# Altium schematic sheet US_IF.SchDoc
size D; DocumentNumber: 2; SheetNumber: 3; SheetTotal: 4; PAGE_TITLE: Acoustic Interface
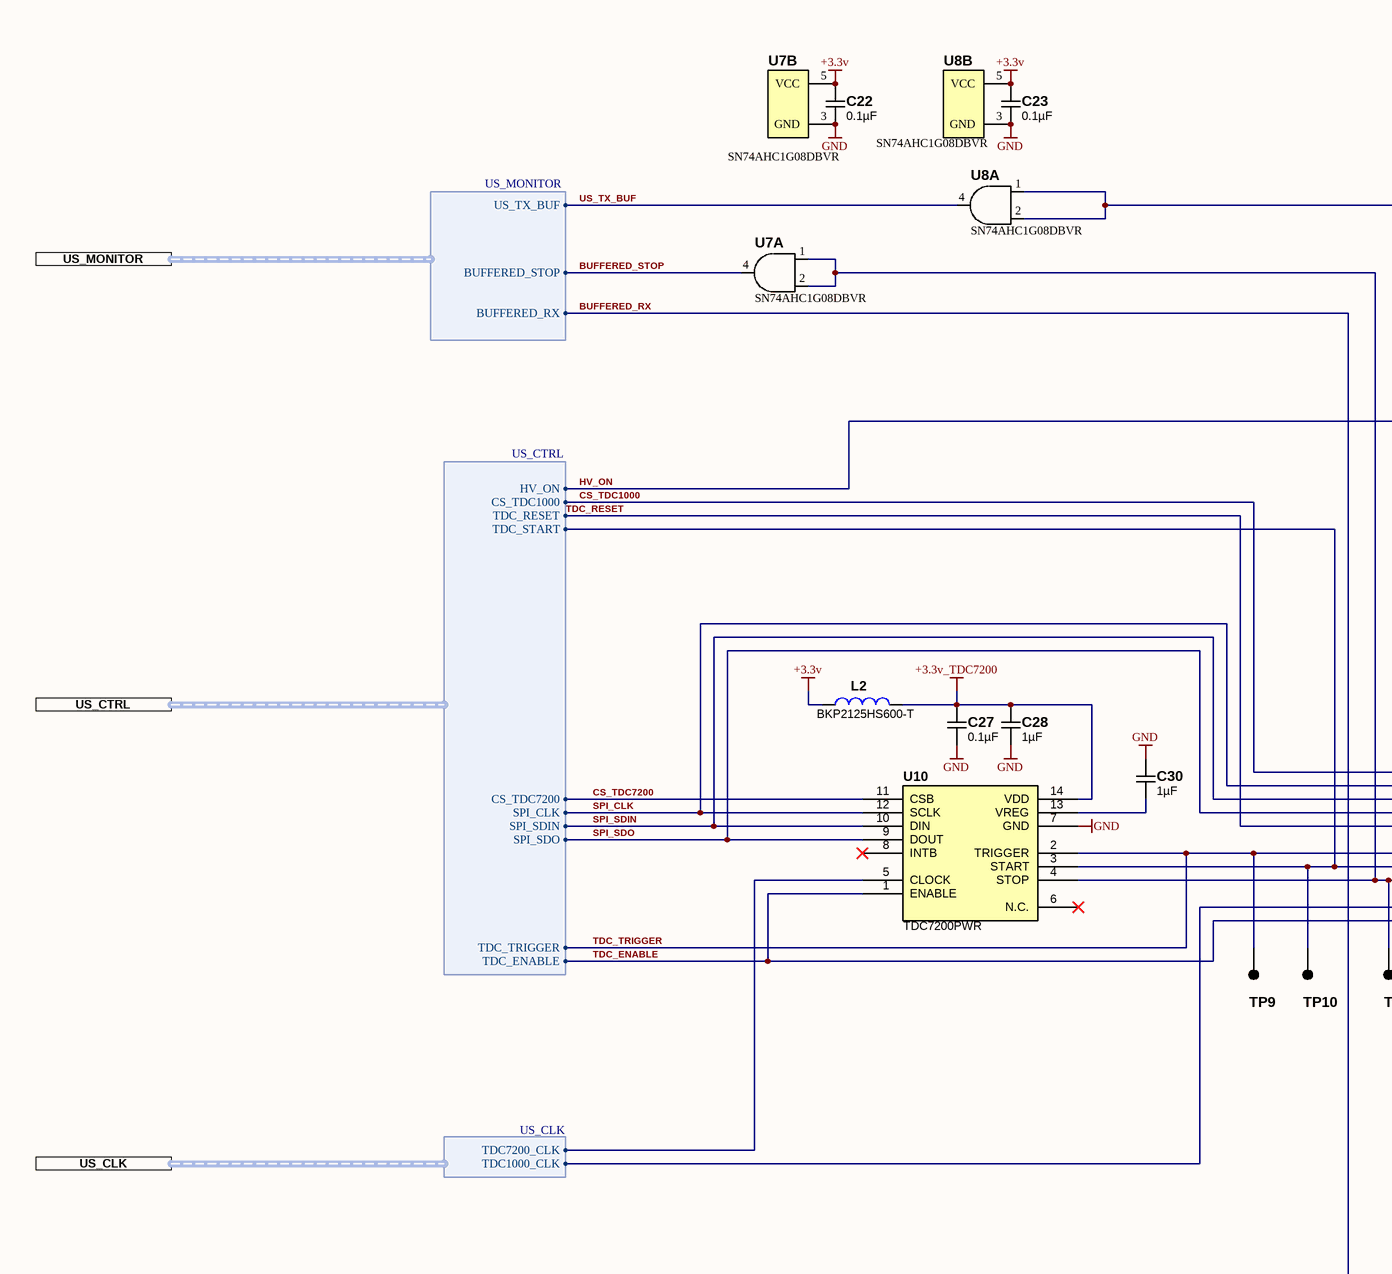
[diagram p0: US_IF.SchDoc, left]
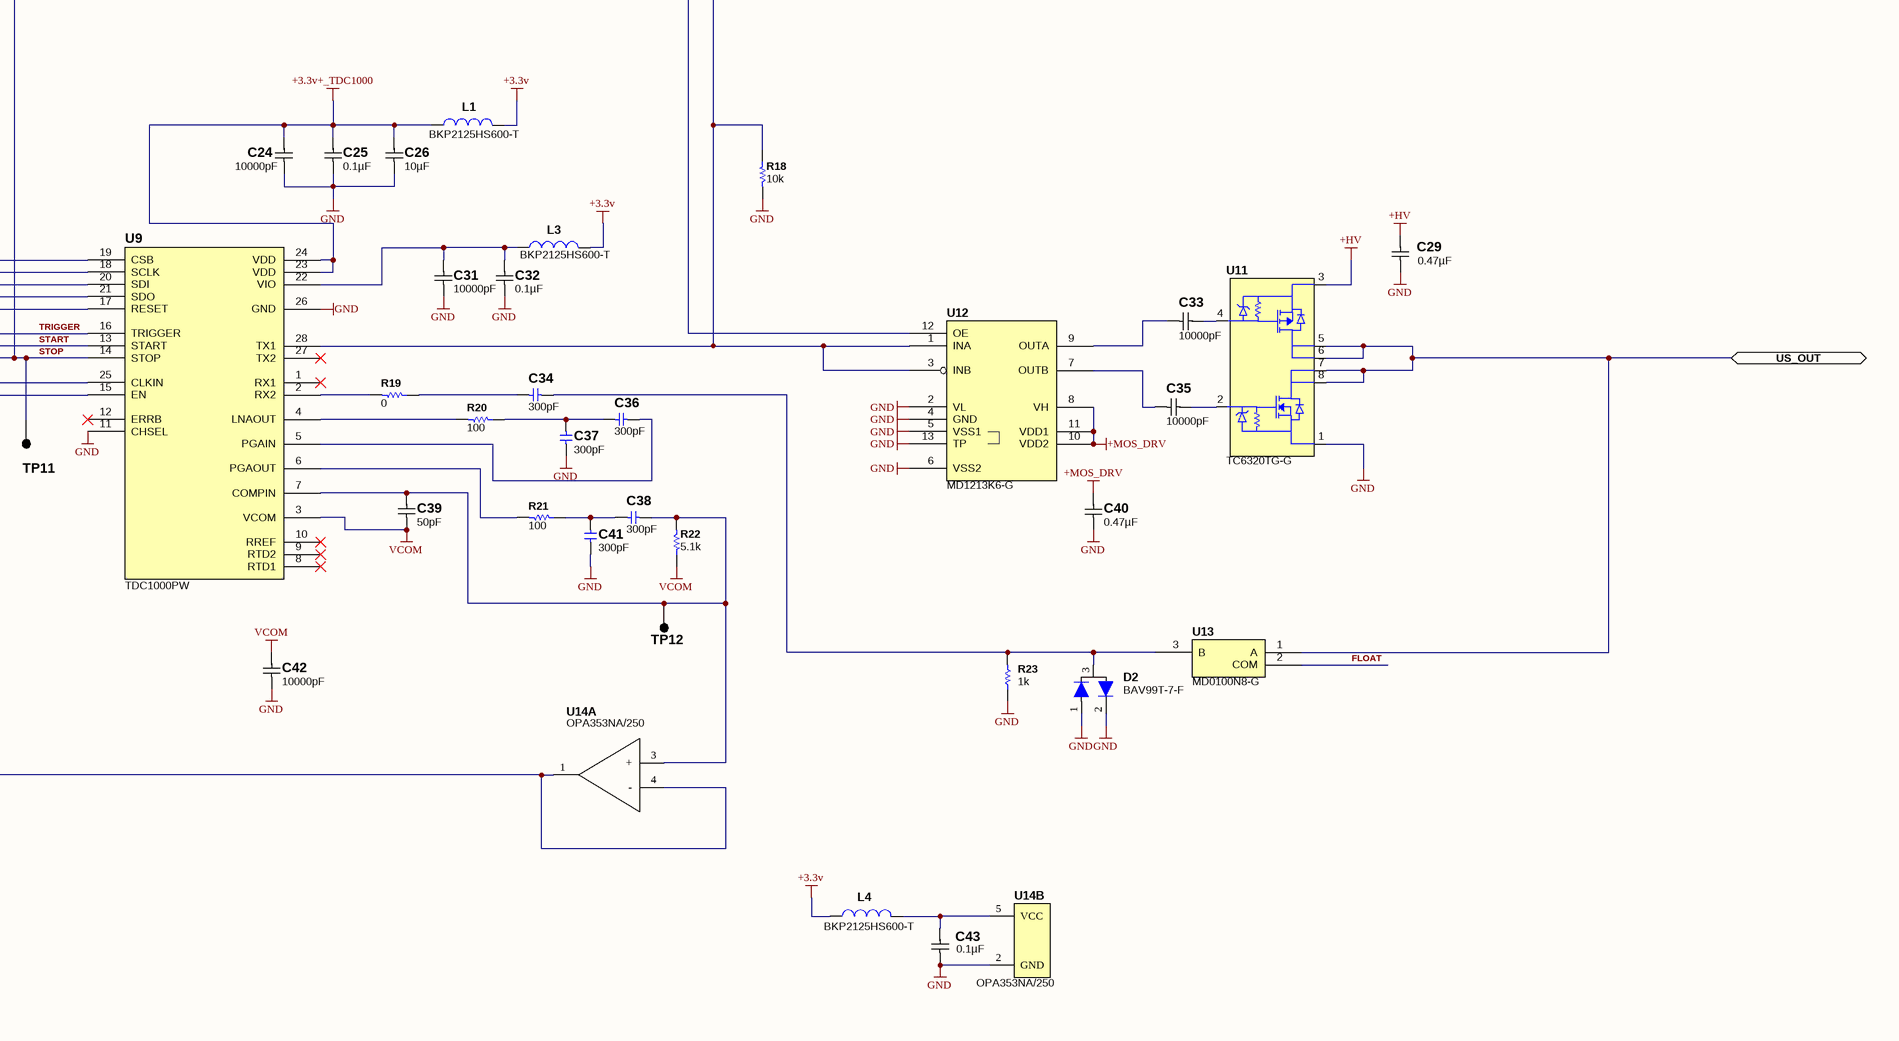
[diagram p1: US_IF.SchDoc, right]

## Parts
C22  0.1µF  [C0603_0.90MM_HD]
C23  0.1µF  [C0603_0.90MM_HD]
C24  10000pF  [C0603_0.95MM_HD]
C25  0.1µF  [C0603_0.90MM_HD]
C26  10µF  [C0805_1.45MM_HD]
C27  0.1µF  [C0603_0.90MM_HD]
C28  1µF  [C0603_0.95MM_HD]
C29  0.47µF  [C0805_1.45MM_HD]
C30  1µF  [C0603_0.95MM_HD]
C31  10000pF  [C0603_0.90MM_HD]
C32  0.1µF  [C0603_0.90MM_HD]
C33  10000pF  [C0603_0.95MM_HD]
C34  300pF  [C0603_0.90mm_MD]
C35  10000pF  [C0603_0.95MM_HD]
C36  300pF  [C0603_0.90mm_MD]
C37  300pF  [C0603_0.90mm_MD]
C38  300pF  [C0603_0.90mm_MD]
C39  50pF  [C0603_0.90MM_HD]
C40  0.47µF  [C0805_1.45MM_HD]
C41  300pF  [C0603_0.90mm_MD]
C42  10000pF  [C0603_0.95MM_HD]
C43  0.1µF  [C0603_0.90MM_HD]
D2  BAV99T-7-F  [D_SOT-523_P]
L1  BKP2125HS600-T  [C0805_0.8mm]
L2  BKP2125HS600-T  [C0805_0.8mm]
L3  BKP2125HS600-T  [C0805_0.8mm]
L4  BKP2125HS600-T  [C0805_0.8mm]
R18  10k  [R0603_0.55MM_HD]
R19  0  [R0603_0.55MM_HD]
R20  100  [R0603_0.55MM_HD]
R21  100  [R0603_0.55MM_HD]
R22  5.1k  [R0603_0.55MM_HD]
R23  1k  [R0603_0.55MM_HD]
TP9  SMT_TEST  [SMT_TP - 25]  (value not drawn)  (no BOM)
TP10  SMT_TEST  [SMT_TP - 25]  (value not drawn)  (no BOM)
TP11  SMT_TEST  [SMT_TP - 25]  (value not drawn)  (no BOM)
TP12  SMT_TEST  [SMT_TP - 25]  (value not drawn)  (no BOM)
U7  SN74AHC1G08DBVR  [SOT95P245X145-5L]  (parts A,B of 2)
U8  SN74AHC1G08DBVR  [SOT95P245X145-5L]  (parts A,B of 2)
U9  TDC1000PW  [TSOP65P640X120-28N]
U10  TDC7200PWR  [TSSOP14]
U11  TC6320TG-G  [SOIC 8]
U12  MD1213K6-G  [QFN80P400X400X100_HS-13N]
U13  MD0100N8-G  [SOT89-150P410X160-3N]
U14  OPA353NA/250  [SOT23-5]  (parts A,B of 2)

## Ports
US_CLK (harness US_CLK), US_CTRL (harness US_CTRL), US_MONITOR (harness US_MONITOR), US_OUT (bidir)

## Harnesses
US_CTRL: HV_ON, CS_TDC1000, SPI_CLK, SPI_SDIN, SPI_SDO, CS_TDC7200, TDC_TRIGGER, TDC_ENABLE, TDC_RESET, TDC_START
US_MONITOR: BUFFERED_STOP, BUFFERED_RX, US_TX_BUF
US_CLK: TDC7200_CLK, TDC1000_CLK

## Nets
+3.3v: C22.2 C23.2 L1.1 L2.2 L3.1 L4.2 U7.5(VCC) U8.5(VCC)
+3.3v+_TDC1000: C24.2 C25.2 C26.2 L1.2 U9.23(VDD) U9.24(VDD)
+3.3v_TDC7200: C27.2 C28.2 L2.1 U10.14(VDD)
+HV: C29.2 U11.3(SP)
+MOS_DRV: C40.2 U12.8(VH) U12.10(VDD2) U12.11(VDD1)
GND: C22.1 C23.1 C24.1 C25.1 C26.1 C27.1 C28.1 C29.1 C30.2 C31.1 C32.1 C37.1 C40.1 C41.2 C42.1 C43.1 D2.1(A) D2.2(C) R18.2 R23.1 U7.3(GND) U8.3(GND) U9.11(CHSEL) U9.26(GND) U10.7(GND) U11.1(SN) U12.2(VL) U12.4(GND) U12.5(VSS1) U12.6(VSS2) U12.13(TP) U14.2(GND)
VCOM: C39.1 C42.2 R22.1 U9.3(VCOM)
BUFFERED_RX: U14.1(OUT) U14.4(-) ; port US_MONITOR.BUFFERED_RX
BUFFERED_STOP: U7.4(OUT) ; port US_MONITOR.BUFFERED_STOP
CS_TDC1000: U9.19(CSB) ; port US_CTRL.CS_TDC1000
CS_TDC7200: U10.11(CSB) ; port US_CTRL.CS_TDC7200
FLOAT: U13.2(COM)
HV_ON: U12.12(OE) ; port US_CTRL.HV_ON
SPI_CLK: U9.18(SCLK) U10.12(SCLK) ; port US_CTRL.SPI_CLK
SPI_SDIN: U9.20(SDI) U10.10(DIN) ; port US_CTRL.SPI_SDIN
SPI_SDO: U9.21(SDO) U10.9(DOUT) ; port US_CTRL.SPI_SDO
START: TP10.1 U9.13(START) U10.3(START) ; port US_CTRL.TDC_START
STOP: TP11.1 U7.1(A) U7.2(B) U9.14(STOP) U10.4(STOP)
TDC_ENABLE: U9.15(EN) U10.1(ENABLE) ; port US_CTRL.TDC_ENABLE
TDC_RESET: U9.17(RESET) ; port US_CTRL.TDC_RESET
TDC_TRIGGER: TP9.1 U9.16(TRIGGER) U10.2(TRIGGER) ; port US_CTRL.TDC_TRIGGER  [also labelled TRIGGER]
US_OUT: U11.5(DN) U11.6(DN) U11.7(DP) U11.8(DP) U13.1(A) ; port US_OUT
US_TX_BUF: U8.4(OUT) ; port US_MONITOR.US_TX_BUF
NetC30_1: C30.1 U10.13(VREG)
NetC31_2: C31.2 C32.2 L3.2 U9.22(VIO)
NetC33_1: C33.1 U12.9(OUTA)
NetC33_2: C33.2 U11.4(GP)
NetC34_1: C34.1 D2.3(AC) R23.2 U13.3(B)
NetC34_2: C34.2 R19.1
NetC35_1: C35.1 U12.7(OUTB)
NetC35_2: C35.2 U11.2(GN)
NetC36_1: C36.1 U9.5(PGAIN)
NetC36_2: C36.2 C37.2 R20.1
NetC38_1: C38.1 C41.1 R21.1
NetC38_2: C38.2 C39.2 R22.2 TP12.1 U9.7(COMPIN) U14.3(+)
NetC43_2: C43.2 L4.1 U14.5(VCC)
NetR18_1: R18.1 U8.1(A) U8.2(B) U9.28(TX1) U12.1(INA) U12.3(INB)
NetR19_2: R19.2 U9.2(RX2)
NetR20_2: R20.2 U9.4(LNAOUT)
NetR21_2: R21.2 U9.6(PGAOUT)
NetU9_25: U9.25(CLKIN) ; port US_CLK.TDC1000_CLK
NetU10_5: U10.5(CLOCK) ; port US_CLK.TDC7200_CLK

Not connected (* = marked no-connect by the designer): U9 1(RX1)* 8(RTD1)* 9(RTD2)* 10(RREF)* 12(ERRB)* 27(TX2)*; U10 6(N.C.)* 8(INTB)*

## Notes on the sheet
- PCB REV
- CCA REV
- Sheet
- of

## Library data of the parts
C22 C23 C25 C27 C32 C43 = CGA3E2X7R1H104K080AE: CAP CER 0.1UF 50V X7R 0603; Manufacturer: TDK Corporation; Tolerance: ±10%; Substitution Notes: 0.1µF , 50V , ±10% , X7R , -55°C ~ 125°C , AEC-Q200 , 0603; Value: 0.1µF; Temperature Coefficient: X7R; Manufacturer Part Number: CGA3E2X7R1H104K080AE; ComponentLink1Description: Datasheet (Internal); ComponentLink1URL: datasheets\TDK\mlcc_automotive_general_en.pdf; ComponentLink2Description: Datasheet (External); ComponentLink2URL: https://product.tdk.com/info/en/catalog/datasheets/mlcc_automotive_general_en.pdf; Supplier 1: Digikey; Supplier Part Number 1: 445-15957-1-ND; Category: Capacitors; Voltage - Rated: 50V; Operating Temperature: -55°C ~ 125°C; Ratings: AEC-Q200; Package: 0603; Thickness (Max): 0.90MM; Features: Soft Termination
C24 C33 C35 C42 = CGA3E1C0G2A103J080AE: CAP CER 10000PF 100V C0GNP0 0603; Manufacturer: TDK Corporation; Temperature Coefficient: C0G, NP0; Tolerance: ±5%; Substitution Notes: 10000pF , 100V , ±5% , C0G, NP0 , -55°C ~ 125°C , AEC-Q200 , 0603; Value: 10000pF; Manufacturer Part Number: CGA3E1C0G2A103J080AE; ComponentLink1Description: Datasheet (Internal); ComponentLink1URL: datasheets\TDK\mlcc_automotive_general_en.pdf; ComponentLink2Description: Datasheet (External); ComponentLink2URL: https://product.tdk.com/info/en/catalog/datasheets/mlcc_automotive_general_en.pdf; Supplier 1: Digikey; Supplier Part Number 1: 445-175658-1-ND; Category: Capacitors; Voltage - Rated: 100V; Operating Temperature: -55°C ~ 125°C; Ratings: AEC-Q200; Package: 0603; Thickness (Max): 0.95MM; Features: Soft Termination
C26 = CGA4J1X7R0J106K125AC: CAP CER 10UF 6.3V X7R 0805; Manufacturer: TDK Corporation; Tolerance: ±10%; Substitution Notes: 10µF , 6.3V , ±10% , X7R , -55°C ~ 125°C , AEC-Q200 , 0805; Value: 10µF; Temperature Coefficient: X7R; Manufacturer Part Number: CGA4J1X7R0J106K125AC; ComponentLink1Description: Datasheet (Internal); ComponentLink1URL: datasheets\TDK\mlcc_automotive_general_en.pdf; ComponentLink2Description: Datasheet (External); ComponentLink2URL: https://product.tdk.com/info/en/catalog/datasheets/mlcc_automotive_general_en.pdf; Supplier 1: Digikey; Supplier Part Number 1: 445-6971-1-ND; Category: Capacitors; Voltage - Rated: 6.3V; Operating Temperature: -55°C ~ 125°C; Ratings: AEC-Q200; Package: 0805; Thickness (Max): 1.45MM; Features: -
C28 C30 = CGA3E1X7R1E105K080AE: CAP CER 1UF 25V X7R 0603; Manufacturer: TDK Corporation; Tolerance: ±10%; Substitution Notes: 1µF , 25V , ±10% , X7R , -55°C ~ 125°C , AEC-Q200 , 0603; Value: 1µF; Temperature Coefficient: X7R; Manufacturer Part Number: CGA3E1X7R1E105K080AE; ComponentLink1Description: Datasheet (Internal); ComponentLink1URL: datasheets\TDK\mlcc_automotive_general_en.pdf; ComponentLink2Description: Datasheet (External); ComponentLink2URL: https://product.tdk.com/info/en/catalog/datasheets/mlcc_automotive_general_en.pdf; Supplier 1: Digikey; Supplier Part Number 1: 445-173628-1-ND; Category: Capacitors; Voltage - Rated: 25V; Operating Temperature: -55°C ~ 125°C; Ratings: AEC-Q200; Package: 0603; Thickness (Max): 0.95MM; Features: Soft Termination
C29 C40 = CGA4J3X7R1H474K125AE: CAP CER 0.47UF 50V X7R 0805; Manufacturer: TDK Corporation; Tolerance: ±10%; Substitution Notes: 0.47µF , 50V , ±10% , X7R , -55°C ~ 125°C , AEC-Q200 , 0805; Value: 0.47µF; Temperature Coefficient: X7R; Manufacturer Part Number: CGA4J3X7R1H474K125AE; ComponentLink1Description: Datasheet (Internal); ComponentLink1URL: datasheets\TDK\mlcc_automotive_general_en.pdf; ComponentLink2Description: Datasheet (External); ComponentLink2URL: https://product.tdk.com/info/en/catalog/datasheets/mlcc_automotive_general_en.pdf; Supplier 1: Digikey; Supplier Part Number 1: 445-8786-1-ND; Category: Capacitors; Voltage - Rated: 50V; Operating Temperature: -55°C ~ 125°C; Ratings: AEC-Q200; Package: 0805; Thickness (Max): 1.45MM; Features: Soft Termination
C31 = CGA3E2X7R1H103M080AE: CAP CER 10000PF 50V X7R 0603; Manufacturer: TDK Corporation; Tolerance: ±20%; Substitution Notes: 10000pF , 50V , ±20% , X7R , -55°C ~ 125°C , AEC-Q200 , 0603; Value: 10000pF; Temperature Coefficient: X7R; Manufacturer Part Number: CGA3E2X7R1H103M080AE; ComponentLink1Description: Datasheet (Internal); ComponentLink1URL: datasheets\TDK\mlcc_automotive_general_en.pdf; ComponentLink2Description: Datasheet (External); ComponentLink2URL: https://product.tdk.com/info/en/catalog/datasheets/mlcc_automotive_general_en.pdf; Supplier 1: Digikey; Supplier Part Number 1: 445-15956-1-ND; Category: Capacitors; Voltage - Rated: 50V; Operating Temperature: -55°C ~ 125°C; Ratings: AEC-Q200; Package: 0603; Thickness (Max): 0.90MM; Features: Soft Termination
C34 C36-C38 C41 = CL10C301JB8NNNC: Cap Ceramic 300pF 50V C0G 5% SMD 0603 125C Paper T/R; Manufacturer: Samsung; Value: 300pF; Manufacturer Part Number: CL10C301JB8NNNC; ComponentLink1Description: https://datasheet.ciiva.com/25733/cl10c301jb8nnnc-25733017.pdf?src-supplier=Digi-Key; ComponentLink1URL: https://datasheet.ciiva.com/25733/cl10c301jb8nnnc-25733017.pdf?src-supplier=Digi-Key; Supplier 1: Digi-Key; Supplier Part Number 1: 1276-2261-1-ND; Tolerance: 5%; Stock 1: 199782; Pricing 1: 1 = 0.10000, 10 = 0.06500, 100 = 0.02910, 500 = 0.02080, 1000 = 0.01634 (USD); RoHS: Yes; Mount: Surface Mount; Case/Package: 0603; Case Code (Metric): 1608; Case Code (Imperial): 0603; Min Operating Temperature: -55°C; Max Operating Temperature: 125°C; Capacitance: 300pF; Dielectric: C0G; Package Quantity: 1; Packaging: Tape and Reel; Voltage Rating: 50V; Voltage Rating (DC): 50V; Length: 1.6mm; Height: 0.8mm; Width: 0.031inch; Thickness: 0.035inch; Depth: 0.8mm; Radiation Hardening: No; Lead Free: Lead Free
C39 = CL10C500JC81PNC: CAP CER 50PF 100V C0G/NP0 0603; Manufacturer: Samsung Electro-Mechanics; Temperature Coefficient: C0G, NP0; Tolerance: ±5%; Substitution Notes: 50pF , 100V , -55°C ~ 125°C , C0G, NP0  , AEC-Q200 , 0603; Value: 50pF; Manufacturer Part Number: CL10C500JC81PNC; ComponentLink1Description: Datasheet (Internal); ComponentLink1URL: datasheets\Samsung\CL05B153KB5VPNC.pdf.pdf; ComponentLink2Description: Datasheet (External); ComponentLink2URL: http://www.samsungsem.com/kr/support/product-search/mlcc/__icsFiles/afieldfile/2017/05/25/CL05B153KB5VPNC.pdf; Supplier 1: Digikey; Supplier Part Number 1: 1276-6589-1-ND; Category: Capacitors; Voltage - Rated: 100V; Operating Temperature: -55°C ~ 125°C; Ratings: AEC-Q200; Package: 0603; Thickness (Max): 0.90MM; Features: -
D2 = BAV99T-7-F: DIODES INC.         BAV99T-7-F            Small Signal Diode, Switching, Dual Series, 85 V, 155 mA, 1.25 V, 4 ns, 4 A; Peak Non-Repetitive Surge Current: 4A; Forward Current: 155mA; Reverse Recovery Time: 4ns; Peak Reverse Current: 2uA; Max Repetitive Reverse Voltage (Vrrm): 85V; Forward Voltage: 1.25V; Power Dissipation: 150mW; Average Rectified Current: 75mA; Capacitance: 1.5pF; Current Rating: 50mA; Supplier 1: Digi-Key; Supplier Part Number 1: BAV99T-FDICT-ND; Manufacturer: Diodes; Manufacturer Part Number: BAV99T-7-F; Stock 1: 184990; Mount: Surface Mount; Case/Package: SOT-523; Number of Pins: 3; Weight: 7.1E-05oz; Contact Plating: Tin,Matte; Min Operating Temperature: -65°C; Max Operating Temperature: 150°C; Packaging: Tape and Reel; Max Surge Current: 4A; Package Quantity: 3000; Recovery Time: 4ns; Max Forward Surge Current (Ifsm): 4A; Max Reverse Voltage (DC): 85V; Length: 1.6mm; Height: 0.75mm; Width: 0.8mm; Lead Free: Lead Free; REACH SVHC: No SVHC; ComponentLink1URL: https://datasheet.ciiva.com/8301/ds30260-8301823.pdf; ComponentLink1Description: https://datasheet.ciiva.com/8301/ds30260-8301823.pdf; ComponentLink2URL: https://datasheet.ciiva.com/25946/ds30260-25946623.pdf; ComponentLink2Description: https://datasheet.ciiva.com/25946/ds30260-25946623.pdf; Value: BAV99T-7-F; Pricing 1: 1=0.34, 10=0.28, 100=0.1485, 500=0.09772, 1000=0.06645 (USD); Power Rating: 150mW; Voltage Rating (DC): 85V; Radiation Hardening: No
L1-L4 = BKP2125HS600-T: FERRITE BEAD 60 OHM 0805 1LN; Manufacturer: Taiyo Yuden; Filter Type: Power Line; Number of Lines: 1; Impedance @ Frequency: 60 Ohm @ 100MHz; Current Rating (Max): 3A; DC Resistance (DCR) (Max): 25 mOhm; Manufacturer Part Number: BKP2125HS600-T; RoHS: RoHS Compliant; Category: Filters; Packaging: Tape & Reel (TR); Ratings: -; Operating Temperature: -55°C ~ 85°C; Package / Case: 0805 (2012 Metric); Mounting Type: Surface Mount; Height (Max): 0.041" (1.05mm); Size / Dimension: 0.079" L x 0.049" W (2.00mm x 1.25mm); ComponentLink1URL: http://ds.yuden.co.jp/TYCOMPAS/ut/detail.do?productNo=BKP2125HS600-T&fileName=BKP2125HS600-T_SS&mode=specSheetDownload; ComponentLink1Description: http://ds.yuden.co.jp/TYCOMPAS/ut/detail.do?productNo=BKP2125HS600-T&fileName=BKP2125HS600-T_SS&mode=specSheetDownload; Value: BKP2125HS600-T; Supplier 1: Digi-Key; Supplier Part Number 1: 587-3973-1-ND; Stock 1: 7069; Pricing 1: 1=0.21, 10=0.17, 50=0.1094, 100=0.0943, 250=0.07548, 500=0.06792, 1000=0.0566 (USD); ComponentLink2URL: http://ds.yuden.co.jp/TYCOMPAS/ut/detail.do?productNo=BKP2125HS600-TV&fileName=BKP2125HS600-TV_SS&mode=specSheetDownload; ComponentLink2Description: http://ds.yuden.co.jp/TYCOMPAS/ut/detail.do?productNo=BKP2125HS600-TV&fileName=BKP2125HS600-TV_SS&mode=specSheetDownload
R18 = ERJ-3EKF1002V: RES 10K OHM 1/10W 1% 0603 SMD; Manufacturer: Panasonic Electronic Components; Package Power: 0603  (0.1W); Power (Watts): 0.1W- 1/10W; Temperature Coefficient: ±100ppm/°C; Limiting Element Voltage: 75; Maximum Overload Voltage: 150; Maximum Working Voltage: 31.6V; Substitution Notes: 10k , ±1% , 0603 , AEC-Q200; Value: 10k; Manufacturer Part Number: ERJ-3EKF1002V; ComponentLink1Description: Internal Datasheet; ComponentLink1URL: datasheets\Panasonic Electronic Components\AOA0000CE2.pdf; ComponentLink2Description: External Datasheet; ComponentLink2URL: http://industrial.panasonic.com/www-data/pdf/AOA0000/AOA0000CE2.pdf; Supplier 1: Digi-Key; Supplier Part Number 1: P10.0KHCT-ND; Category: Resistors; Resistance (Ohms): 10k; Composition: Thick Film; Features: -; Tolerance: ±1%; Package: 0603 (1608 Metric); Supplier Package: 0603; Size / Dimension: 0.063" L x 0.031" W (1.60mm x 0.80mm); Height: 0.55MM; Number of Terminations: 2; Packaging: Cut Tape (CT); Sort Value: 10000; Sort Value Package: 603_10000; Ratings: AEC-Q200
R19 = ERJ-3GEY0R00V: RES 0.0 OHM 1/10W JUMP 0603 SMD; Manufacturer: Panasonic Electronic Components; Package Power: 0603  (0.1W); Power (Watts): 0.1W- 1/10W; Tolerance: Jumper; Limiting Element Voltage: 75; Maximum Overload Voltage: 150; Maximum Working Voltage: 0.0V; Substitution Notes: 0 , Jumper , 0603 , AEC-Q200; Value: 0; Manufacturer Part Number: ERJ-3GEY0R00V; ComponentLink1Description: Internal Datasheet; ComponentLink1URL: datasheets\Panasonic Electronic Components\AOA0000CE1.pdf; ComponentLink2Description: External Datasheet; ComponentLink2URL: http://industrial.panasonic.com/www-data/pdf/AOA0000/AOA0000CE1.pdf; Supplier 1: Digi-Key; Supplier Part Number 1: P0.0GCT-ND; Category: Resistors; Resistance (Ohms): 0; Composition: Thick Film; Features: -; Temperature Coefficient: -; Package: 0603 (1608 Metric); Supplier Package: 0603; Size / Dimension: 0.063" L x 0.031" W (1.60mm x 0.80mm); Height: 0.55MM; Number of Terminations: 2; Sort Value: 0; Sort Value Package: 603_0; Ratings: AEC-Q200
R20 R21 = ERJ-3EKF1000V: RES 100 OHM 1/10W 1% 0603 SMD; Manufacturer: Panasonic Electronic Components; Package Power: 0603  (0.1W); Power (Watts): 0.1W- 1/10W; Temperature Coefficient: ±100ppm/°C; Limiting Element Voltage: 75; Maximum Overload Voltage: 150; Maximum Working Voltage: 3.2V; Substitution Notes: 100 , ±1% , 0603 , AEC-Q200; Value: 100; Manufacturer Part Number: ERJ-3EKF1000V; ComponentLink1Description: Internal Datasheet; ComponentLink1URL: datasheets\Panasonic Electronic Components\AOA0000CE2.pdf; ComponentLink2Description: External Datasheet; ComponentLink2URL: http://industrial.panasonic.com/www-data/pdf/AOA0000/AOA0000CE2.pdf; Supplier 1: Digi-Key; Supplier Part Number 1: P100HCT-ND; Category: Resistors; Resistance (Ohms): 100; Composition: Thick Film; Features: -; Tolerance: ±1%; Package: 0603 (1608 Metric); Supplier Package: 0603; Size / Dimension: 0.063" L x 0.031" W (1.60mm x 0.80mm); Height: 0.55MM; Number of Terminations: 2; Packaging: Cut Tape (CT); Sort Value: 100; Sort Value Package: 603_100; Ratings: AEC-Q200
R22 = ERJ-3EKF5101V: RES 5.1K OHM 1/10W 1% 0603 SMD; Manufacturer: Panasonic Electronic Components; Package Power: 0603  (0.1W); Power (Watts): 0.1W- 1/10W; Temperature Coefficient: ±100ppm/°C; Limiting Element Voltage: 75; Maximum Overload Voltage: 150; Maximum Working Voltage: 22.6V; Substitution Notes: 5.1k , ±1% , 0603 , AEC-Q200; Value: 5.1k; Manufacturer Part Number: ERJ-3EKF5101V; ComponentLink1Description: Internal Datasheet; ComponentLink1URL: datasheets\Panasonic Electronic Components\AOA0000CE2.pdf; ComponentLink2Description: External Datasheet; ComponentLink2URL: http://industrial.panasonic.com/www-data/pdf/AOA0000/AOA0000CE2.pdf; Supplier 1: Digi-Key; Supplier Part Number 1: P5.10KHCT-ND; Category: Resistors; Resistance (Ohms): 5.1k; Composition: Thick Film; Features: -; Tolerance: ±1%; Package: 0603 (1608 Metric); Supplier Package: 0603; Size / Dimension: 0.063" L x 0.031" W (1.60mm x 0.80mm); Height: 0.55MM; Number of Terminations: 2; Packaging: Cut Tape (CT); Sort Value: 5100; Sort Value Package: 603_5100; Ratings: AEC-Q200
R23 = ERJ-3EKF1001V: RES 1K OHM 1/10W 1% 0603 SMD; Manufacturer: Panasonic Electronic Components; Package Power: 0603  (0.1W); Power (Watts): 0.1W- 1/10W; Temperature Coefficient: ±100ppm/°C; Limiting Element Voltage: 75; Maximum Overload Voltage: 150; Maximum Working Voltage: 10.0V; Substitution Notes: 1k , ±1% , 0603 , AEC-Q200; Value: 1k; Manufacturer Part Number: ERJ-3EKF1001V; ComponentLink1Description: Internal Datasheet; ComponentLink1URL: datasheets\Panasonic Electronic Components\AOA0000CE2.pdf; ComponentLink2Description: External Datasheet; ComponentLink2URL: http://industrial.panasonic.com/www-data/pdf/AOA0000/AOA0000CE2.pdf; Supplier 1: Digi-Key; Supplier Part Number 1: P1.00KHCT-ND; Category: Resistors; Resistance (Ohms): 1k; Composition: Thick Film; Features: -; Tolerance: ±1%; Package: 0603 (1608 Metric); Supplier Package: 0603; Size / Dimension: 0.063" L x 0.031" W (1.60mm x 0.80mm); Height: 0.55MM; Number of Terminations: 2; Packaging: Cut Tape (CT); Sort Value: 1000; Sort Value Package: 603_1000; Ratings: AEC-Q200
U7 U8 = SN74AHC1G08DBVR: IC SGL 2IN POS-AND GATE SOT23-5; Manufacturer: Texas Instruments; Number of Inputs: 2; Number of Circuits: 1; Current - Output High, Low: 8mA, 8mA; Voltage - Supply: 2 V ~ 5.5 V; Supplier 1: Digi-Key; Supplier Part Number 1: 296-1091-1-ND; Manufacturer Part Number: SN74AHC1G08DBVR; RoHS: RoHS Compliant; Category: Integrated Circuits (ICs); Stock 1: 63967; Pricing 1: 1=0.53, 25=0.31, 100=0.25, 250=0.18, 500=0.145, 1000=0.1125 (USD); Logic Type: AND Gate; Operating Temperature: -40°C ~ 85°C; Mounting Type: Surface Mount; Package / Case: SOT-23-5, SC-74A, SOT-25; Packaging: Cut Tape (CT); Supplier Device Package: *; ComponentLink1URL: http://focus.ti.com/lit/ds/symlink/sn74ahc1g08.pdf; ComponentLink1Description: http://focus.ti.com/lit/ds/symlink/sn74ahc1g08.pdf; Value: SN74AHC1G08DBVR
U9 = TDC1000PW: IC AFE ULTRA SENSING 28TSSOP; Manufacturer: Texas Instruments; Input Type: Ultrasound; Output Type: Digital; Interface: SPI; Supplier 1: Digi-Key; Manufacturer Part Number: TDC1000PW; RoHS: RoHS Compliant; Category: Integrated Circuits (ICs); Stock 1: 125; Pricing 1: 1=6.61, 10=5.152, 25=4.1796, 100=3.5964, 250=3.3048, 500=3.0132, 1000=2.8188 (USD); Packaging: Tray; Part Status: Active; Type: Front End; Operating Temperature: -40°C ~ 125°C; Mounting Type: Surface Mount; Package / Case: 28-TSSOP (0.173", 4.40mm Width); Supplier Device Package: 28-TSSOP; ComponentLink1URL: http://www.ti.com/lit/ds/symlink/tdc1000.pdf; ComponentLink1Description: http://www.ti.com/lit/ds/symlink/tdc1000.pdf; Supplier Part Number 1: 296-39657-ND; Value: TDC1000PW
U10 = TDC7200PWR: IC DIG CONV 14TSSOP; Manufacturer: Texas Instruments; Input Type: Ultrasound; Output Type: Digital; Interface: SPI; Value: TDC7200PWR; Supplier 1: Digi-Key; Supplier Part Number 1: 296-44361-6-ND; Manufacturer Part Number: TDC7200PWR; RoHS: RoHS Compliant; Category: Integrated Circuits (ICs); Stock 1: 2396; Pricing 1: 1=2.77, 10=2.138, 25=1.782, 100=1.5048, 250=1.4256, 500=1.2672, 1000=1.188 (USD); Packaging: Digi-Reel®; Part Status: Active; Type: Time to Flight to Digital Converter; Operating Temperature: -40°C ~ 85°C; Mounting Type: Surface Mount; Package / Case: 14-TSSOP (0.173", 4.40mm Width); Supplier Device Package: 14-TSSOP; ComponentLink1URL: http://www.ti.com/lit/ds/symlink/tdc7200.pdf; ComponentLink1Description: http://www.ti.com/lit/ds/symlink/tdc7200.pdf
U11 = TC6320TG-G: Trans MOSFET N/P-CH 200V 8-Pin SOIC N T/R; Manufacturer: Microchip Supertex; Rise Time: 15ns; Drain to Source Resistance: 8R; Turn-Off Delay Time: 20ns; Turn-On Delay Time: 10ns; Continuous Drain Current (ID): -2A; Number of Elements: 2; On-State Resistance: 15R; Value: TC6320TG-G; Supplier 1: Digi-Key; Supplier Part Number 1: TC6320TG-GCT-ND; Manufacturer Part Number: TC6320TG-G; Stock 1: 1592; Pricing 1: 1=1.42, 25=1.1768, 100=1.114 (USD); Mount: Surface Mount; Case/Package: SOIC; Number of Pins: 8; Min Operating Temperature: -55°C; Max Operating Temperature: 150°C; Package Quantity: 2000; Packaging: Tape and Reel; Fall Time: 15ns; Drain to Source Breakdown Voltage: 200V; Radiation Hardening: No; ComponentLink1URL: https://datasheet.ciiva.com/30195/tc6320-30195222.pdf; ComponentLink1Description: https://datasheet.ciiva.com/30195/tc6320-30195222.pdf; Supplier 2: Digi-Key; Supplier Part Number 2: MD0100N8-GCT-ND; Stock 2: 609; Pricing 2: 1=1.24, 25=1.0284, 100=0.9328 (USD); Length: 4.6mm; ComponentLink2URL: https://datasheet.ciiva.com/15746/md0100-15746487.pdf; ComponentLink2Description: https://datasheet.ciiva.com/15746/md0100-15746487.pdf; ComponentLink3URL: https://datasheet.ciiva.com/30248/656md0100-30248377.pdf; ComponentLink3Description: https://datasheet.ciiva.com/30248/656md0100-30248377.pdf
U12 = MD1213K6-G: Gate Drivers HI SPD DUAL MOSFET DRIVER; Manufacturer: Microchip Supertex; Max Supply Voltage: 13V; Max Output Current: 2A; Min Supply Voltage: 4.5V; Rise Time: 6ns; Number of Outputs: 2; Operating Supply Voltage: 12V; Frequency: 100kHz; Nominal Supply Current: 550uA; Propagation Delay: 7ns; Value: MD1213K6-G; Supplier 1: Digi-Key; Supplier Part Number 1: MD1213K6-GCT-ND; Manufacturer Part Number: MD1213K6-G; Stock 1: 2628; Pricing 1: 1=1.61, 25=1.3464, 100=1.219 (USD); Mount: Surface Mount; Case/Package: QFN; Number of Pins: 12; Min Operating Temperature: -20°C; Max Operating Temperature: 85°C; Packaging: Tape and Reel; Package Quantity: 3000; Output Current: 2A; Number of Drivers: 2; Fall Time: 6ns; ComponentLink1URL: https://datasheet.ciiva.com/4898/md1213-30882-4898732.pdf; ComponentLink1Description: https://datasheet.ciiva.com/4898/md1213-30882-4898732.pdf; ComponentLink2URL: https://datasheet.ciiva.com/30175/md1213-30175933.pdf; ComponentLink2Description: https://datasheet.ciiva.com/30175/md1213-30175933.pdf
U13 = MD0100N8-G: High Voltage Protection T/R Switch 4-Pin(3+Tab) SOT-89; Manufacturer: Microchip Supertex; On-State Resistance: 15R; Value: MD0100N8-G; Supplier 1: Digi-Key; Supplier Part Number 1: MD0100N8-GCT-ND; Manufacturer Part Number: MD0100N8-G; Stock 1: 609; Pricing 1: 1=1.24, 25=1.0284, 100=0.9328 (USD); Mount: Surface Mount; Case/Package: SOT-89; Number of Pins: 4; Min Operating Temperature: -40°C; Max Operating Temperature: 125°C; Packaging: Tape and Reel; Package Quantity: 2000; Length: 4.6mm; ComponentLink1URL: https://datasheet.ciiva.com/15746/md0100-15746487.pdf; ComponentLink1Description: https://datasheet.ciiva.com/15746/md0100-15746487.pdf; ComponentLink2URL: https://datasheet.ciiva.com/30248/656md0100-30248377.pdf; ComponentLink2Description: https://datasheet.ciiva.com/30248/656md0100-30248377.pdf
U14 = OPA353NA/250: IC OPAMP GP 44MHZ RRO SOT23-5; Manufacturer: Texas Instruments; Amplifier Type: General Purpose; Number of Circuits: 1; Output Type: Rail-to-Rail; Slew Rate: 22 V/µs; Current - Input Bias: 0.5pA; Voltage - Input Offset: 3mV; Current - Supply: 5.2mA; Current - Output / Channel: 40mA; Voltage - Supply, Single/Dual (±): 2.5 V ~ 5.5 V, ±1.25 V ~ 2.75 V; Value: OPA353NA/250; Supplier 1: Digi-Key; Supplier Part Number 1: OPA353NACT-ND; Manufacturer Part Number: OPA353NA/250; RoHS: RoHS Compliant; Category: Integrated Circuits (ICs); Stock 1: 21970; Pricing 1: 1=2.98, 10=2.671, 100=2.1909 (USD); Packaging: Cut Tape (CT); Gain Bandwidth Product: 44MHz; -3db Bandwidth: -; Operating Temperature: -40°C ~ 85°C; Mounting Type: Surface Mount; Package / Case: SC-74A, SOT-753; Supplier Device Package: SOT-23-5; ComponentLink1URL: http://www.ti.com/lit/ds/symlink/opa353.pdf; ComponentLink1Description: http://www.ti.com/lit/ds/symlink/opa353.pdf
TP9-TP12 = SMT_TEST: Value: SMT_TEST